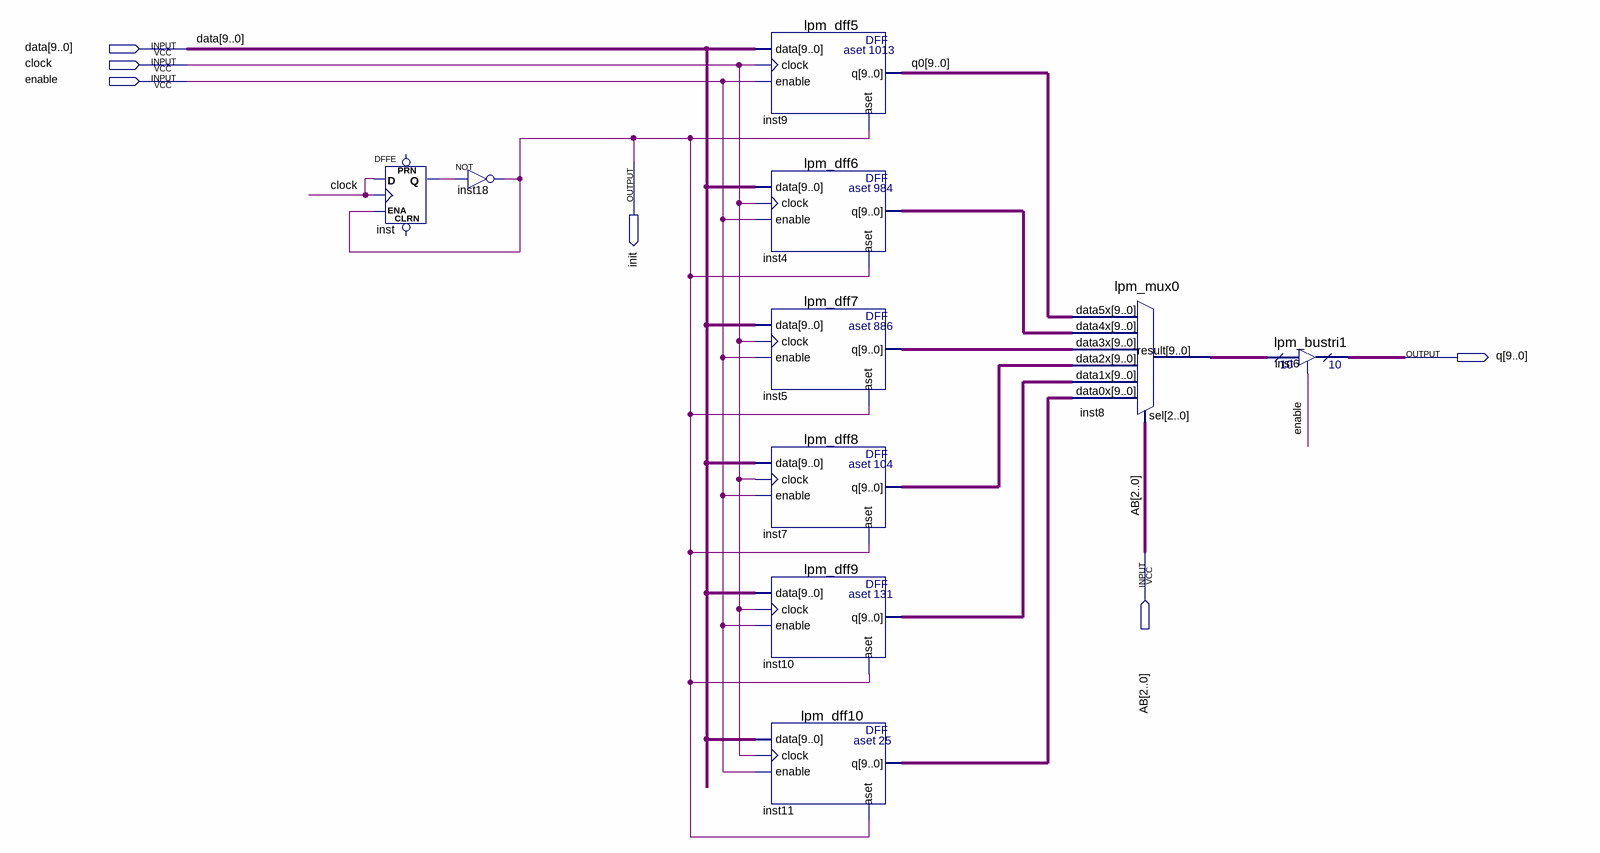
[diagram p0: schematic sheet]
// Quartus schematic GPR.bdf as structural Verilog: 10 symbols, 6 pins
module GPR (
  input  [9:0] data,
  input  clock,
  input  enable,
  input  [2:0] AB,
  output init,
  output [9:0] q
);

  wire inst_q;
  wire [9:0] inst4_q, inst5_q, inst7_q, inst8_result, inst10_q, inst11_q, q0;

  DFFE inst (.D(clock), .CLK(clock), .ENA(init), .Q(inst_q));  // open: PRN, CLRN
  not inst18 (init, inst_q);
  lpm_dff5 inst9 (.data(data), .clock(clock), .enable(enable), .aset(init), .q(q0));
  lpm_dff6 inst4 (.data(data), .clock(clock), .enable(enable), .aset(init), .q(inst4_q));
  lpm_dff7 inst5 (.data(data), .clock(clock), .enable(enable), .aset(init), .q(inst5_q));
  lpm_dff8 inst7 (.data(data), .clock(clock), .enable(enable), .aset(init), .q(inst7_q));
  lpm_dff9 inst10 (.data(data), .clock(clock), .enable(enable), .aset(init), .q(inst10_q));
  lpm_dff10 inst11 (.data(data), .clock(clock), .enable(enable), .aset(init), .q(inst11_q));
  lpm_mux0 inst8 (
    .data5x(q0), .data4x(inst4_q), .data3x(inst5_q), .data2x(inst7_q), .data1x(inst10_q), .data0x(inst11_q),
    .sel(AB), .result(inst8_result));
  lpm_bustri1 inst6 (.enabledt(enable), .data(inst8_result), .tridata(q));
endmodule
